# Altium project ESP32-C3 DEV-M-1.PrjPcb
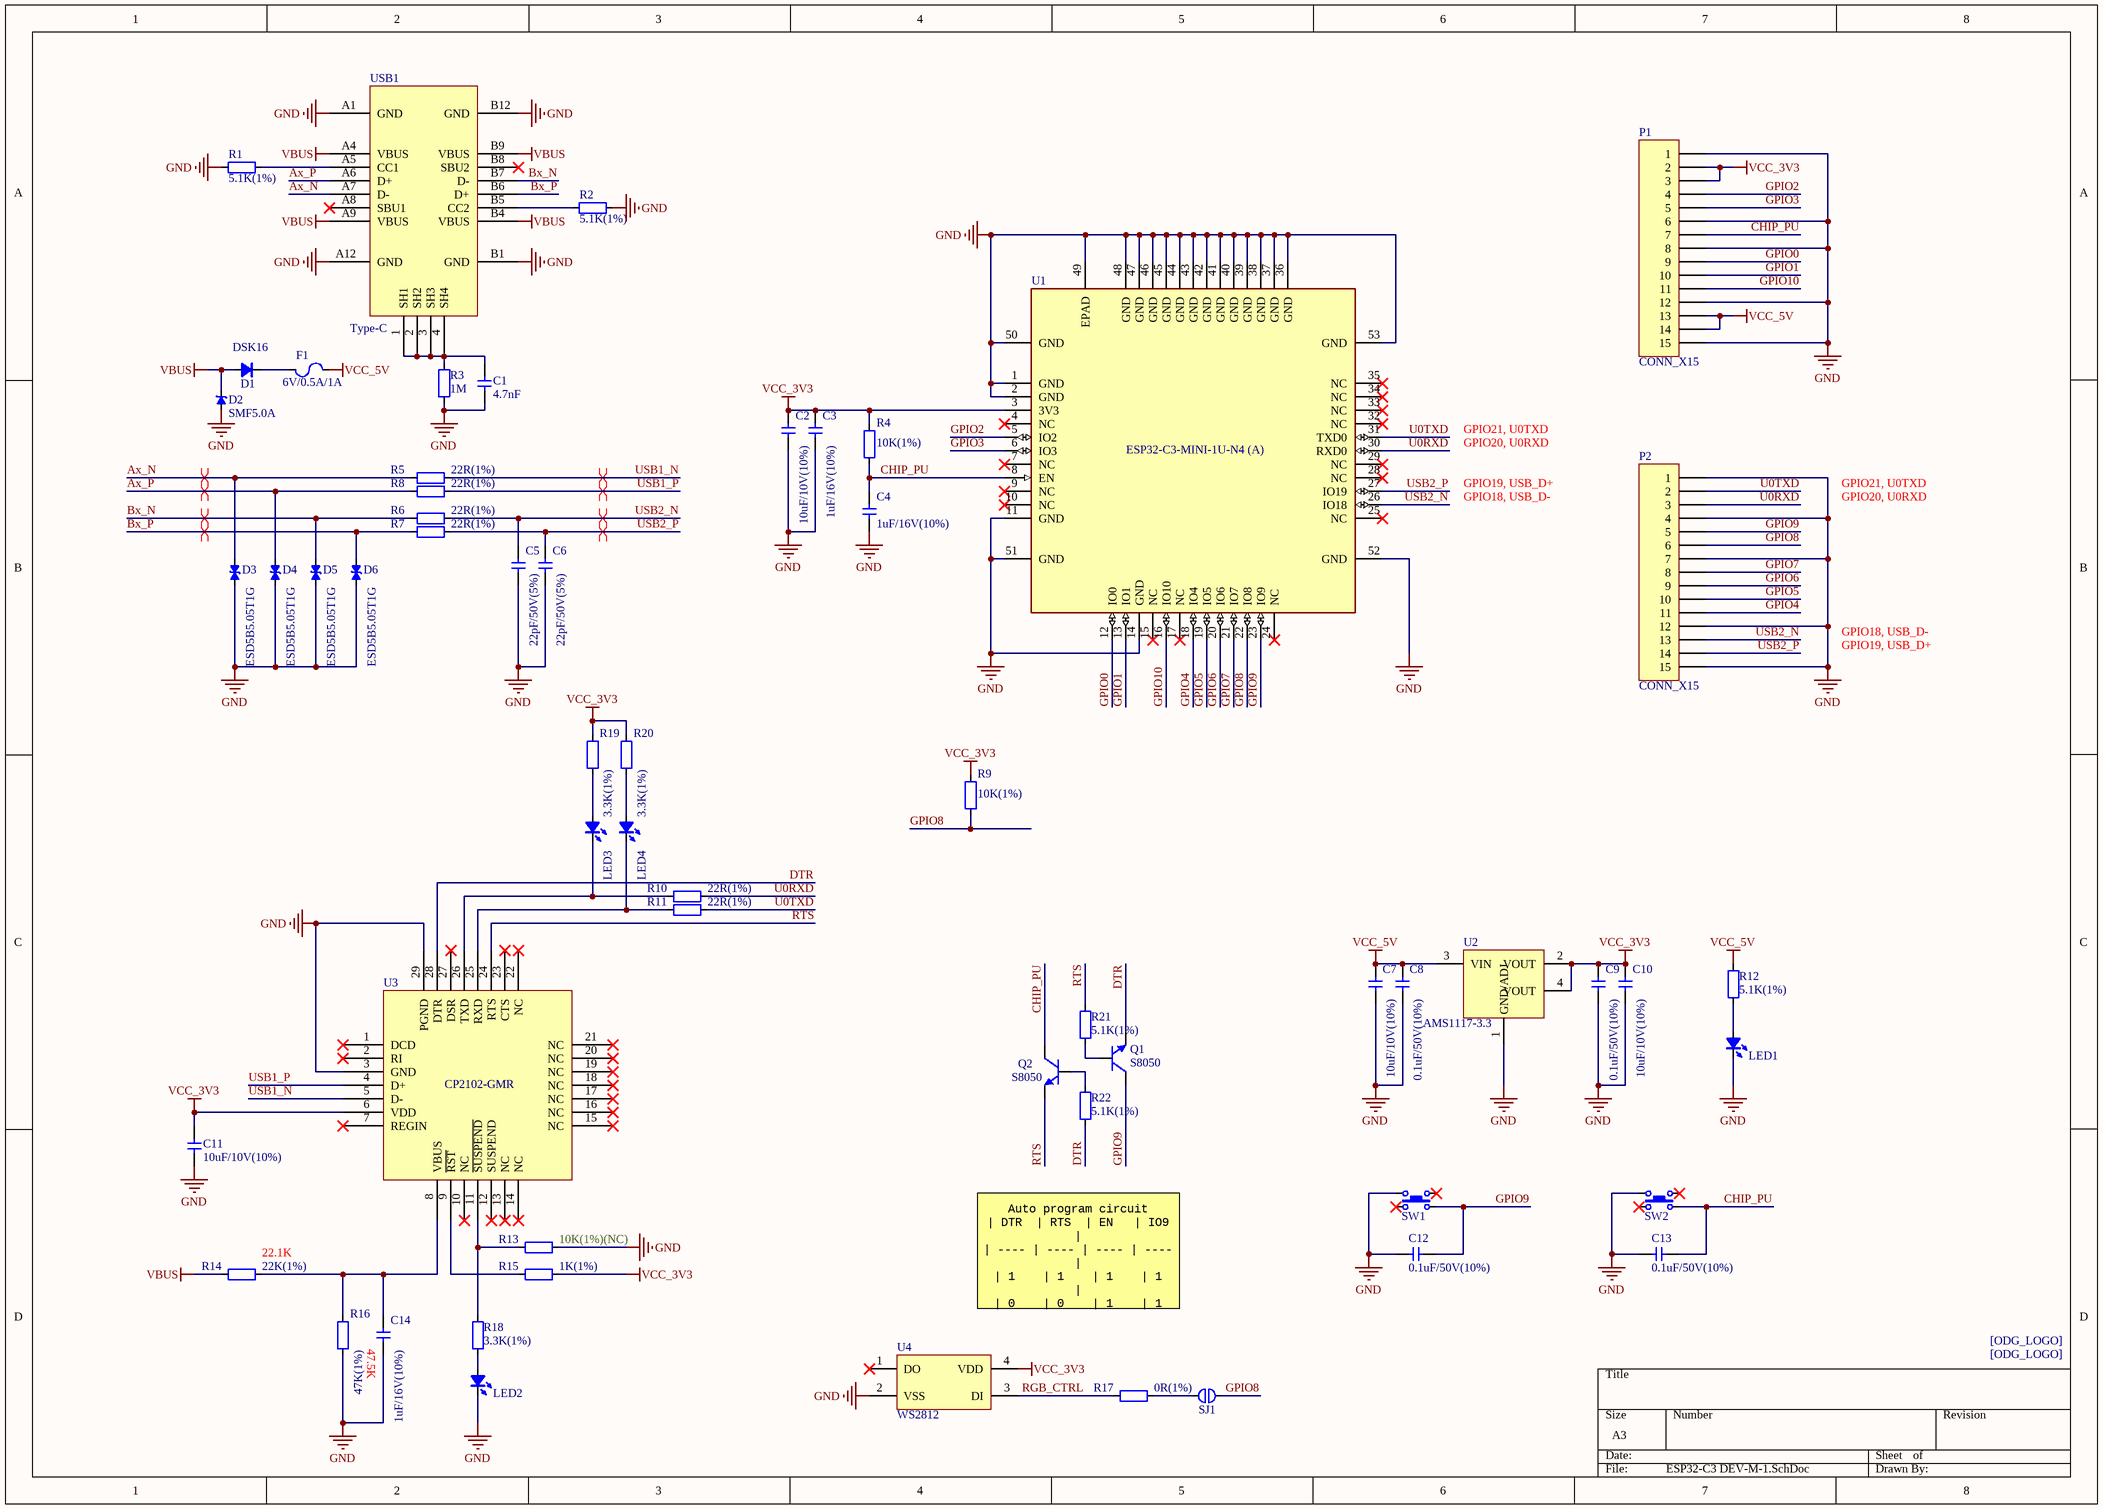
[diagram p0: ESP32-C3 DEV-M-1.SchDoc]
1 sheet, 61 parts. Net scope: global (net labels, ports and power ports of the same name join across sheets).
Board file: ESP32-C3 DEV-M-1.PcbDoc

## Sheet ESP32-C3 DEV-M-1.SchDoc: ESP32-C3 DEV-M-1
size A3; DrawnBy: OldGerman; SheetNumber: 1; SheetTotal: 1

### Parts
C1  4.7nF  [C0402]
C2  10uF/10V(10%)  [C0603]
C3  1uF/16V(10%)  [C0402]
C4  1uF/16V(10%)  [C0402]
C5  22pF/50V(5%)  [C0402]
C6  22pF/50V(5%)  [C0402]
C7  10uF/10V(10%)  [C0603]
C8  0.1uF/50V(10%)  [C0402]
C9  0.1uF/50V(10%)  [C0402]
C10  10uF/10V(10%)  [C0603]
C11  10uF/10V(10%)  [C0603]
C12  0.1uF/50V(10%)  [C0402]
C13  0.1uF/50V(10%)  [C0402]
C14  1uF/16V(10%)  [C0402]
D1  DSK16  [SOD123F]
D2  SMF5.0A  [SOD123F]
D3  ESD5B5.05T1G  [SOD-523]
D4  ESD5B5.05T1G  [SOD-523]
D5  ESD5B5.05T1G  [SOD-523]
D6  ESD5B5.05T1G  [SOD-523]
F1  6V/0.5A/1A  [FUSE0603_0.5MM]
LED1  LED  [LED0603_RED]  (value not drawn)
LED2  LED  [LED0603_RED]  (value not drawn)
LED3  LED  [LED0603_RED]  (value not drawn)
LED4  LED  [LED0603_RED]  (value not drawn)
ODG1  ODG_LOGO  [ODG_LOGO]  (value not drawn)
ODG2  ODG_LOGO  [ODG_LOGO]  (value not drawn)
P1  CONN_X15  [2.54MM_MALE_X15]
P2  CONN_X15  [2.54MM_MALE_X15]
Q1  S8050  [INFINEON SOT-23-3]
Q2  S8050  [INFINEON SOT-23-3]
R1  5.1K(1%)  [R0402]
R2  5.1K(1%)  [R0402]
R3  1M  [R0402]
R4  10K(1%)  [R0402]
R5  22R(1%)  [R0402]
R6  22R(1%)  [R0402]
R7  22R(1%)  [R0402]
R8  22R(1%)  [R0402]
R9  10K(1%)  [R0402]
R10  22R(1%)  [R0402]
R11  22R(1%)  [R0402]
R12  5.1K(1%)  [R0402]
R13  10K(1%)(NC)  [R0402]
R14  22K(1%)  [R0402]
R15  1K(1%)  [R0402]
R16  47K(1%)  [R0402]
R17  0R(1%)  [R0402]
R18  3.3K(1%)  [R0402]
R19  3.3K(1%)  [R0402]
R20  3.3K(1%)  [R0402]
R21  5.1K(1%)  [R0402]
R22  5.1K(1%)  [R0402]
SJ1  SJ_2P  [SJ_2P_MINI]  (value not drawn)
SW1  Button-4P  [SWITCH_3X4X2.5_4PIN_SMD]  (value not drawn)
SW2  Button-4P  [SWITCH_3X4X2.5_4PIN_SMD]  (value not drawn)
U1  ESP32-C3-MINI-1U-N4 (A)  [XCVR_ESP32-C3-MINI-1U-N4]
U2  AMS1117-3.3  [TI SOT-223 DCY]
U3  CP2102-GMR  [QFN-28_EP]
U4  WS2812  [WS2812_2020]
USB1  Type-C  [Type-C-TOP]

### Nets
GND: C1.2 C2.1 C3.1 C4.1 C5.1 C6.1 C7.1 C8.1 C9.1 C10.1 C11.1 C12.2 C13.2 C14.1 D2.1 D3.1 D4.1 D5.1 D6.1 LED1.2(K) LED2.2(K) P1.1 P1.6 P1.8 P1.12 P1.15 P2.1 P2.4 P2.7 P2.12 P2.15 R1.1 R2.2 R3.2 R13.1 R16.1 SW1.1 SW2.1 U1.1(GND) U1.2(GND) U1.11(GND) U1.14(GND) U1.36(GND) U1.37(GND) U1.38(GND) U1.39(GND) U1.40(GND) U1.41(GND) U1.42(GND) U1.43(GND) U1.44(GND) U1.45(GND) U1.46(GND) U1.47(GND) U1.48(GND) U1.49(EPAD) U1.50(GND) U1.51(GND) U1.52(GND) U1.53(GND) U2.1(GND/ADJ) U3.3(GND) U3.29(PGND) U4.2(VSS) USB1.A1(GND) USB1.A12(GND) USB1.B1(GND) USB1.B12(GND)
VBUS: D1.1(A) D2.2 R14.2 USB1.A4(VBUS) USB1.A9(VBUS) USB1.B4(VBUS) USB1.B9(VBUS)
VCC_3V3: C2.2 C3.2 C9.2 C10.2 C11.2 P1.2 P1.3 R4.2 R9.2 R15.1 R19.2 R20.2 U1.3(3V3) U2.2(VOUT) U2.4(VOUT) U3.6(VDD) U4.4(VDD)
VCC_5V: C7.2 C8.2 F1.2 P1.13 P1.14 R12.2 U2.3(VIN)
Ax_N: D3.2 R5.2 USB1.A7(D-)
Ax_P: D4.2 R8.2 USB1.A6(D+)
Bx_N: D5.2 R6.2 USB1.B7(D-)
Bx_P: D6.2 R7.2 USB1.B6(D+)
CHIP_PU: C4.2 C13.1 P1.7 Q2.3(C) R4.1 SW2.4 U1.8(EN)
DTR: Q1.2(E) R22.1 U3.28(DTR)
GPIO0: P1.9 U1.12(IO0)
GPIO1: P1.10 U1.13(IO1)
GPIO2: P1.4 U1.5(IO2)
GPIO3: P1.5 U1.6(IO3)
GPIO4: P2.11 U1.18(IO4)
GPIO5: P2.10 U1.19(IO5)
GPIO6: P2.9 U1.20(IO6)
GPIO7: P2.8 U1.21(IO7)
GPIO8: P2.6 R9.1 SJ1.2 U1.22(IO8)
GPIO9: C12.1 P2.5 Q1.3(C) SW1.4 U1.23(IO9)
GPIO10: P1.11 U1.16(IO10)
RGB_CTRL: R17.2 U4.3(DI)
RTS: Q2.2(E) R21.2 U3.24(RTS)
U0RXD: P2.3 R10.1 U1.30(RXD0)
U0TXD: P2.2 R11.1 U1.31(TXD0)
USB1_N: R5.1 U3.5(D-)
USB1_P: R8.1 U3.4(D+)
USB2_N: C5.2 P2.13 R6.1 U1.26(IO18)
USB2_P: C6.2 P2.14 R7.1 U1.27(IO19)
NetC1_1: C1.1 R3.1 USB1.1(SH1) USB1.2(SH2) USB1.3(SH3) USB1.4(SH4)
NetC14_2: C14.2 R14.1 R16.2 U3.8(VBUS)
NetD1_2: D1.2(C) F1.1
NetLED1_1: LED1.1(A) R12.1
NetLED2_1: LED2.1(A) R18.1
NetLED3_1: LED3.1(A) R19.1
NetLED3_2: LED3.2(K) R10.2 U3.26(TXD)
NetLED4_1: LED4.1(A) R20.1
NetLED4_2: LED4.2(K) R11.2 U3.25(RXD)
NetQ1_1: Q1.1(B) R21.1
NetQ2_1: Q2.1(B) R22.2
NetR1_2: R1.2 USB1.A5(CC1)
NetR2_1: R2.1 USB1.B5(CC2)
NetR13_2: R13.2 R18.2 U3.11(~{SUSPEND})
NetR15_2: R15.2 U3.9(~{RST})
NetR17_1: R17.1 SJ1.1

Not connected (* = marked no-connect by the designer): SW1 2* 3*; SW2 2* 3*; U1 4(NC)* 7(NC)* 9(NC)* 10(NC)* 15(NC)* 17(NC)* 24(NC)* 25(NC)* 28(NC)* 29(NC)* 32(NC)* 33(NC)* 34(NC)* 35(NC)*; U3 1(DCD)* 2(RI)* 7(REGIN)* 10(NC)* 12(SUSPEND)* 13(NC)* 14(NC)* 15(NC)* 16(NC)* 17(NC)* 18(NC)* 19(NC)* 20(NC)* 21(NC)* 22(NC)* 23(CTS)* 27(DSR)*; U4 1(DO)*; USB1 A8(SBU1)* B8(SBU2)*

### Layout directives
differential pair: Ax_N, Ax_P, Bx_N, Bx_P, USB1_N, USB1_P, USB2_N, USB2_P

### Notes on the sheet
- GPIO21, U0TXD
- GPIO20, U0RXD
- GPIO19, USB_D+
- GPIO18, USB_D-
- (near R14) 22.1K
- Auto program circuit
  | DTR  | RTS  | EN   | IO9  |
  | ---- | ---- | ---- | ---- |
  | 1    | 1    | 1    | 1    |
  | 0    | 0    | 1    | 1    |
  | 1    | 0    | 0    | 1    |
  | 0    | 1    | 1    | 0    |
- (near C14) 47.5K
- (in symbol ODG_LOGO) [ODG_LOGO]

### Library data of the parts
C1-C14 = CAP: Capacitor
D1 = DIODE: 二极管
D2 = TVS_U: 极性：Unidirectional; MF: Taiwan Semiconductor Corporation; MP: TESD5V0L1UC RJG; Digi-Key_Part_Number: TESD5V0L1UCRJGTR-ND; Check_prices: https://www.snapeda.com/parts/TESD5V0L1UC%20RJG/Taiwan+Semiconductor/view-part/?ref=eda; SnapEDA_Link: https://www.snapeda.com/parts/TESD5V0L1UC%20RJG/Taiwan+Semiconductor/view-part/?ref=snap; Package: DFN1006L Taiwan Semiconductor; Purchase-URL: https://pricing.snapeda.com/search/part/TESD5V0L1UC RJG/?ref=eda; Value: *
D3-D6 = TVS_BI: 极性：Bidirectional; MF: Taiwan Semiconductor Corporation; MP: TESD5V0L1UC RJG; Digi-Key_Part_Number: TESD5V0L1UCRJGTR-ND; Check_prices: https://www.snapeda.com/parts/TESD5V0L1UC%20RJG/Taiwan+Semiconductor/view-part/?ref=eda; SnapEDA_Link: https://www.snapeda.com/parts/TESD5V0L1UC%20RJG/Taiwan+Semiconductor/view-part/?ref=snap; Package: DFN1006L Taiwan Semiconductor; Purchase-URL: https://pricing.snapeda.com/search/part/TESD5V0L1UC RJG/?ref=eda; Value: *
F1 = FUSE: 贴片自恢复保险丝
LED1-LED4 = LED: Value: color?
Q1 Q2 = NPN: NPN型
R1-R22 = RES: Resistor
SJ1 = SJ_2P: 焊接跳线
SW1 SW2 = Button-4P: Button
U1 = ESP32-C3-MINI-1U-N4 (A): Bluetooth, WiFi 802.11b/g/n, Bluetooth v5.0 Transceiver Module 2.412GHz ~ 2.484GHz Antenna Not Included, I-PEX Rev3 Surface Mount; MF: Espressif Systems; SnapEDA_Link: https://www.snapeda.com/parts/ESP32-C3-MINI-1U-N4/Espressif+Systems/view-part/?ref=snap; Check_prices: https://www.snapeda.com/parts/ESP32-C3-MINI-1U-N4/Espressif+Systems/view-part/?ref=eda; Digi-Key_Part_Number: 1965-ESP32-C3-MINI-1U-N4TR-ND; Package: None; Purchase-URL: https://pricing.snapeda.com/search/part/ESP32-C3-MINI-1U-N4/?ref=eda; Value: *; MP: ESP32-C3-MINI-1U-N4
U2 = AMS1117: 线性稳压芯片
U3 = CP2102 QFN28 (A): USB转TTL; PART DESC: SINGLE-CHIP USB TO UART BRIDGE, QFN28, RoHS.; PART NUMBER: CP2102; MFG #1: SILICON LABS; Value: Value; RefDes: RefDes; Type: DEV
USB1 = USB-Type-C_16P